# EAGLE design OpenRobot (EAGLE 9.5.2)
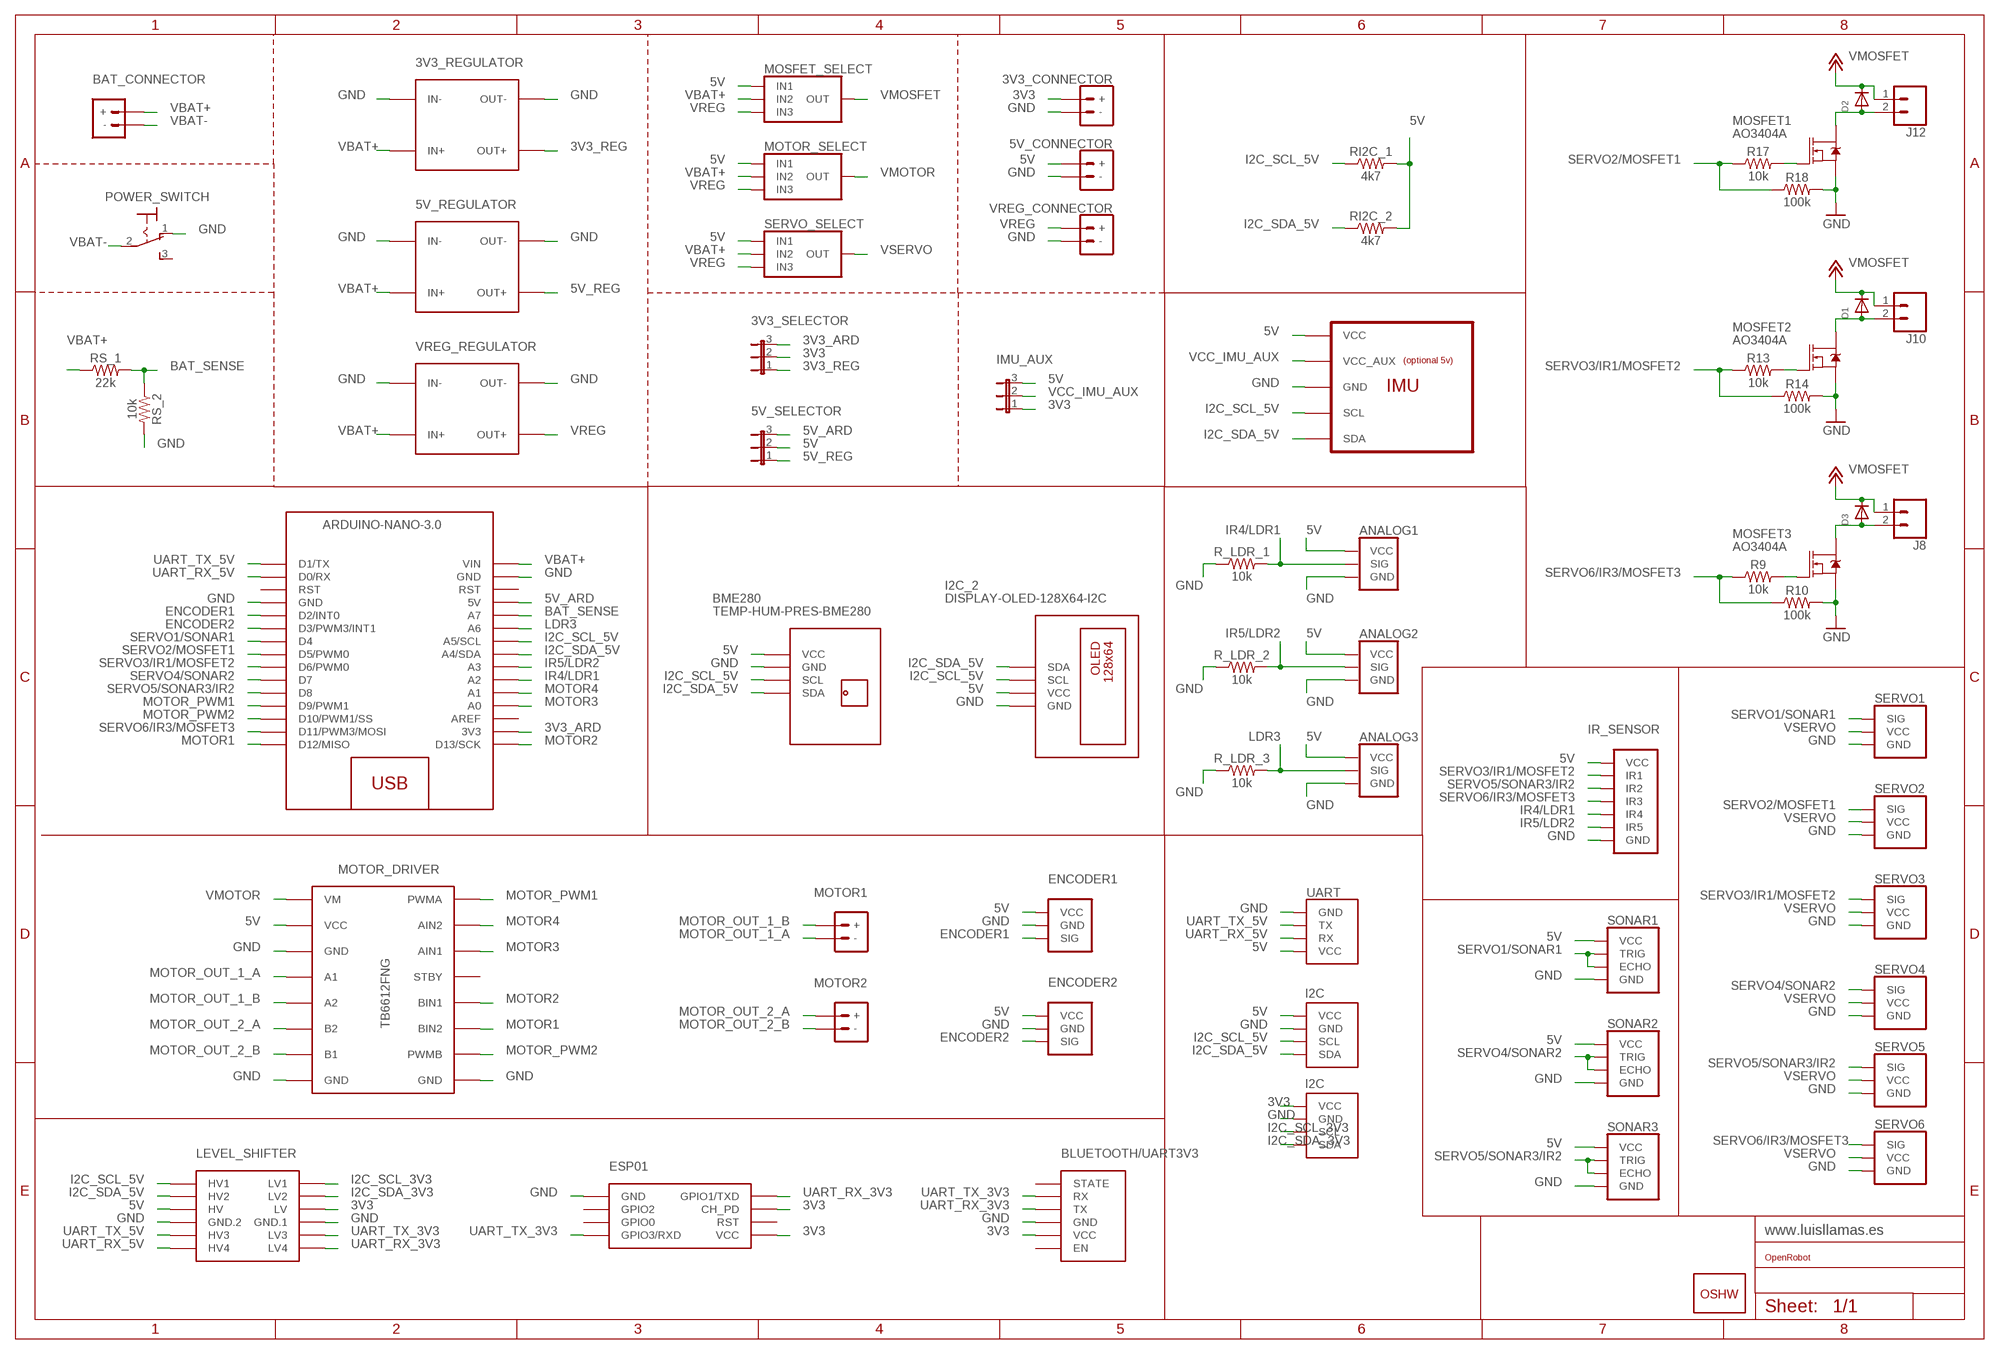
[diagram p0: schematic, sheet 1]

## Parts
3V3_CONNECTOR  MOTOR-TERMINAL2.54MM_SCREWTERM  [1X02_2.54_SCREWTERM]
3V3_REGULATOR  MINI-DC-STEP-DOWN-MP2307  [MINI-DC-STEP-DOWN-MP2307]
3V3_SELECTOR  1  JP2E  [JP2]
5V_CONNECTOR  MOTOR-TERMINAL2.54MM_SCREWTERM  [1X02_2.54_SCREWTERM]
5V_REGULATOR  MINI-DC-STEP-DOWN-MP2307  [MINI-DC-STEP-DOWN-MP2307]
5V_SELECTOR  1  JP2E  [JP2]
ANALOG1  LDR/OCT  [LDR]
ANALOG2  LDR/OCT  [LDR]
ANALOG3  LDR/OCT  [LDR]
ARDUINO_NANO1  ARDUINO-NANO-3.0  [ARDUINO-NANO-3.0]
BAT_CONNECTOR  POWER-TERMINAL5MM  [SCREWTERMINAL-5MM-2]
BLUETOOTH/UART3V3  BLUETOOTH-HC-05  [BLUETOOTH-HC-05]
BME280  TEMP-HUM-PRES-BME280  [TEMP-HUM-PRES-BME280]
D1  DIODESOD-123  [SOD-123]
D2  DIODESOD-123  [SOD-123]
D3  DIODESOD-123  [SOD-123]
ENCODER1  ENCODER/OCT  [ENCODER]
ENCODER2  ENCODER/OCT  [ENCODER]
GOLD_ORB_SM1  OSHWLOGO_GOLD_ORB_MED  [OSHW1]
I2C_1  I2C  GENERIC_I2CVCC_GND_SCL_SDA  [I2C_VCC_GND_SCL_SDA]
I2C_2  DISPLAY-OLED-128X64-I2C  [DISPLAY-OLED-128X64-I2C]
I2C_3  I2C  GENERIC_I2CVCC_GND_SCL_SDA  [I2C_VCC_GND_SCL_SDA]
IMU_AUX  1  JP2E  [JP2]
IR_SENSOR  IR-5/OCT  [IR-5]
J8  CONN_02LOCK_LONGPADS  [1X02_LOCK_LONGPADS]
J10  CONN_02LOCK_LONGPADS  [1X02_LOCK_LONGPADS]
J12  CONN_02LOCK_LONGPADS  [1X02_LOCK_LONGPADS]
LEVEL_SHIFTER  LEVEL-SHIFTER-4CH  [LEVEL-SHIFTER-4CH]
MOSFET1  AO3404A  MOSFET-NCH-AO3404A  [SOT23-3]
MOSFET2  AO3404A  MOSFET-NCH-AO3404A  [SOT23-3]
MOSFET3  AO3404A  MOSFET-NCH-AO3404A  [SOT23-3]
MOSFET_SELECT  JUMPER_3-1  [JUMPER_3-1]
MOTOR1  MOTOR-TERMINAL5MM  [SCREWTERMINAL-5MM-2]
MOTOR2  MOTOR-TERMINAL5MM  [SCREWTERMINAL-5MM-2]
MOTOR_DRIVER  TB6612FNG  [TB6612FNG]
MOTOR_SELECT  JUMPER_3-1  [JUMPER_3-1]
POWER_SWITCH  LEVER-POWER-SWITCH  [M9040P]
R9  10k  RESISTOR1206  [1206]
R10  100k  RESISTOR1206  [1206]
R13  10k  RESISTOR1206  [1206]
R14  100k  RESISTOR1206  [1206]
R17  10k  RESISTOR1206  [1206]
R18  100k  RESISTOR1206  [1206]
R_LDR_1  10k  RESISTOR1206  [1206]
R_LDR_2  10k  RESISTOR1206  [1206]
R_LDR_3  10k  RESISTOR1206  [1206]
RI2C_1  4k7  RESISTOR1206  [1206]
RI2C_2  4k7  RESISTOR1206  [1206]
RS_1  22k  RESISTOR1206  [1206]
RS_2  10k  RESISTOR1206  [1206]
SERVO1  SERVOSERVO  [SERVO]
SERVO2  SERVOSERVO  [SERVO]
SERVO3  SERVOSERVO  [SERVO]
SERVO4  SERVOSERVO  [SERVO]
SERVO5  SERVOSERVO  [SERVO]
SERVO6  SERVOSERVO  [SERVO]
SERVO_SELECT  JUMPER_3-1  [JUMPER_3-1]
SONAR1  ULTRASONIC/OCT  [ULTRASONIC]
SONAR2  ULTRASONIC/OCT  [ULTRASONIC]
SONAR3  ULTRASONIC/OCT  [ULTRASONIC]
U1  IMU_6/9/10DOFMPU6050  [IMU_6/9/10DOF]
U$1  ESP01  [ESP01]
UART  UART  GENERIC_UARTGND_TX_RX_VCC  [GENERIC_UART]
VREG_CONNECTOR  MOTOR-TERMINAL2.54MM_SCREWTERM  [1X02_2.54_SCREWTERM]
VREG_REGULATOR  MINI-DC-STEP-DOWN-MP2307  [MINI-DC-STEP-DOWN-MP2307]

## Nets
3V3: 3V3_CONNECTOR.+ 3V3_SELECTOR.2 BLUETOOTH/UART3V3.VCC I2C_3.VCC IMU_AUX.1 LEVEL_SHIFTER.J1.3(LV) U$1.CH_PD U$1.VCC
3V3_ARD: 3V3_SELECTOR.3 ARDUINO_NANO1.3V3
3V3_REG: 3V3_REGULATOR.OUT2.+(OUT+) 3V3_REGULATOR.OUT+ 3V3_SELECTOR.1
5V: 5V_CONNECTOR.+ 5V_SELECTOR.2 ANALOG1.VCC ANALOG2.VCC ANALOG3.VCC BME280.VCC ENCODER1.VCC ENCODER2.VCC I2C_1.VCC I2C_2.VCC IMU_AUX.3 IR_SENSOR.VCC LEVEL_SHIFTER.J2.3(HV) MOSFET_SELECT.IN1 MOTOR_DRIVER.VCC MOTOR_SELECT.IN1 RI2C_1.2 RI2C_2.2 SERVO_SELECT.IN1 SONAR1.VCC SONAR2.VCC SONAR3.VCC U1.VCC UART.VCC
5V_ARD: 5V_SELECTOR.3 ARDUINO_NANO1.5V
5V_REG: 5V_REGULATOR.OUT2.+(OUT+) 5V_REGULATOR.OUT+ 5V_SELECTOR.1
BAT_SENSE: ARDUINO_NANO1.A7 RS_1.2 RS_2.1
ENCODER1: ARDUINO_NANO1.D2(D2/INT0) ENCODER1.SIG
ENCODER2: ARDUINO_NANO1.D3(D3/PWM3/INT1) ENCODER2.SIG
GND: 3V3_CONNECTOR.- 3V3_REGULATOR.IN- 3V3_REGULATOR.OUT- 5V_CONNECTOR.- 5V_REGULATOR.IN- 5V_REGULATOR.OUT- ANALOG1.GND ANALOG2.GND ANALOG3.GND ARDUINO_NANO1.GND@1(GND) ARDUINO_NANO1.GND@2(GND) BLUETOOTH/UART3V3.GND BME280.GND ENCODER1.GND ENCODER2.GND I2C_1.GND I2C_2.GND I2C_3.GND IR_SENSOR.GND LEVEL_SHIFTER.J1.4(GND.1) LEVEL_SHIFTER.J2.4(GND.2) MOSFET1.2(S) MOSFET2.2(S) MOSFET3.2(S) MOTOR_DRIVER.GND1(GND) MOTOR_DRIVER.GND2(GND) MOTOR_DRIVER.GND3(GND) POWER_SWITCH.1(O) R10.2 R14.2 R18.2 R_LDR_1.1 R_LDR_2.1 R_LDR_3.1 RS_2.2 SERVO1.GND SERVO2.GND SERVO3.GND SERVO4.GND SERVO5.GND SERVO6.GND SONAR1.GND SONAR2.GND SONAR3.GND U1.GND U$1.GND UART.GND VREG_CONNECTOR.- VREG_REGULATOR.IN- VREG_REGULATOR.OUT-
I2C_SCL_3V3: I2C_3.SCL LEVEL_SHIFTER.J1.1(LV1)
I2C_SCL_5V: ARDUINO_NANO1.A5(A5/SCL) BME280.SCL I2C_1.SCL I2C_2.SCL LEVEL_SHIFTER.J2.1(HV1) RI2C_1.1 U1.SCL
I2C_SDA_3V3: I2C_3.SDA LEVEL_SHIFTER.J1.2(LV2)
I2C_SDA_5V: ARDUINO_NANO1.A4(A4/SDA) BME280.SDA I2C_1.SDA I2C_2.SDA LEVEL_SHIFTER.J2.2(HV2) RI2C_2.1 U1.SDA
IR4/LDR1: ANALOG1.SIG ARDUINO_NANO1.A2 IR_SENSOR.4(IR4) R_LDR_1.2
IR5/LDR2: ANALOG2.SIG ARDUINO_NANO1.A3 IR_SENSOR.5(IR5) R_LDR_2.2
LDR3: ANALOG3.SIG ARDUINO_NANO1.A6 R_LDR_3.2
MOTOR1: ARDUINO_NANO1.D12(D12/MISO) MOTOR_DRIVER.BIN2
MOTOR2: ARDUINO_NANO1.D13(D13/SCK) MOTOR_DRIVER.BIN1
MOTOR3: ARDUINO_NANO1.A0 MOTOR_DRIVER.AIN1
MOTOR4: ARDUINO_NANO1.A1 MOTOR_DRIVER.AIN2
MOTOR_OUT_1_A: MOTOR1.- MOTOR_DRIVER.A1
MOTOR_OUT_1_B: MOTOR1.+ MOTOR_DRIVER.A2
MOTOR_OUT_2_A: MOTOR2.+ MOTOR_DRIVER.B2
MOTOR_OUT_2_B: MOTOR2.- MOTOR_DRIVER.B1
MOTOR_PWM1: ARDUINO_NANO1.D9(D9/PWM1) MOTOR_DRIVER.PWMA
MOTOR_PWM2: ARDUINO_NANO1.D10(D10/PWM1/SS) MOTOR_DRIVER.PWMB
N$14: MOSFET3.1(G) R9.2
N$15: D3.A J8.2 MOSFET3.3(D)
N$20: MOSFET2.1(G) R13.2
N$21: D1.A J10.2 MOSFET2.3(D)
N$26: MOSFET1.1(G) R17.2
N$27: D2.A J12.2 MOSFET1.3(D)
SERVO1/SONAR1: ARDUINO_NANO1.D4 SERVO1.SIG SONAR1.ECHO SONAR1.TRIG
SERVO2/MOSFET1: ARDUINO_NANO1.D5(D5/PWM0) R17.1 R18.1 SERVO2.SIG
SERVO3/IR1/MOSFET2: ARDUINO_NANO1.D6(D6/PWM0) IR_SENSOR.1(IR1) R13.1 R14.1 SERVO3.SIG
SERVO4/SONAR2: ARDUINO_NANO1.D7 SERVO4.SIG SONAR2.ECHO SONAR2.TRIG
SERVO5/SONAR3/IR2: ARDUINO_NANO1.D8 IR_SENSOR.2(IR2) SERVO5.SIG SONAR3.ECHO SONAR3.TRIG
SERVO6/IR3/MOSFET3: ARDUINO_NANO1.D11(D11/PWM3/MOSI) IR_SENSOR.3(IR3) R9.1 R10.1 SERVO6.SIG
UART_RX_3V3: BLUETOOTH/UART3V3.TX LEVEL_SHIFTER.J1.6(LV4) U$1.TX(GPIO1/TXD)
UART_RX_5V: ARDUINO_NANO1.RX0(D0/RX) LEVEL_SHIFTER.J2.6(HV4) UART.RX
UART_TX_3V3: BLUETOOTH/UART3V3.RX LEVEL_SHIFTER.J1.5(LV3) U$1.RX(GPIO3/RXD)
UART_TX_5V: ARDUINO_NANO1.TX1(D1/TX) LEVEL_SHIFTER.J2.5(HV3) UART.TX
VBAT+: 3V3_REGULATOR.IN+ 3V3_REGULATOR.IN.2+(IN+) 5V_REGULATOR.IN+ 5V_REGULATOR.IN.2+(IN+) ARDUINO_NANO1.VIN BAT_CONNECTOR.+ MOSFET_SELECT.IN2 MOTOR_SELECT.IN2 RS_1.1 SERVO_SELECT.IN2 VREG_REGULATOR.IN+ VREG_REGULATOR.IN.2+(IN+)
VBAT-: BAT_CONNECTOR.- POWER_SWITCH.2(P)
VCC_IMU_AUX: IMU_AUX.2 U1.VCC_AUX
VMOSFET: D1.C D2.C D3.C J8.1 J10.1 J12.1 MOSFET_SELECT.OUT ; supply symbol labelled +12V
VMOTOR: MOTOR_DRIVER.VM MOTOR_SELECT.OUT
VREG: MOSFET_SELECT.IN3 MOTOR_SELECT.IN3 SERVO_SELECT.IN3 VREG_CONNECTOR.+ VREG_REGULATOR.OUT2.+(OUT+) VREG_REGULATOR.OUT+
VSERVO: SERVO1.VCC SERVO2.VCC SERVO3.VCC SERVO4.VCC SERVO5.VCC SERVO6.VCC SERVO_SELECT.OUT
Unconnected: ARDUINO_NANO1.REG(AREF) ARDUINO_NANO1.RST@1(RST) ARDUINO_NANO1.RST@2(RST) BLUETOOTH/UART3V3.EN BLUETOOTH/UART3V3.STATE MOTOR_DRIVER.STBY POWER_SWITCH.3(S) U$1.GPIO0 U$1.GPIO2 U$1.RST

## Library data of the parts
3V3_CONNECTOR 5V_CONNECTOR VREG_CONNECTOR = LLL_Motors:MOTOR-TERMINAL: Multi connection point. Often used as Generic Header-pin footprint for 0.1 inch spaced/style header connections On any of the 0.1 inch spaced packages, you can populate with these: Break Away Headers - Straight <https://www.sparkfun.com/products/116> (PRT-00116) Break Away Male Headers - Right Angle <https://www.sparkfun.com/products/553> (PRT-00553) Female Headers <https://www.sparkfun.com/products/115> (PRT-00115) Break Away Headers - Machine Pin <https://www.sparkfun.com/products/117> (PRT-00117) Break Away Female Headers - Swiss Machine Pin <https://www.sparkfun.com/products/743> (PRT-00743) For SCREWTERMINALS and SPRING TERMINALS visit here: Screw Terimnals on SparkFun.com <https://www.sparkfun.com/search/results?term=Screw+Terminals> (5mm/3.5mm/2.54mm spacing) This device is also useful as a general connection point to wire up your design to another part of your project. Our various solder wires solder well into these plated through hole pads. Hook-Up Wire - Assortment (Stranded, 22 AWG) <https://www.sparkfun.com/products/11375> (PRT-11375) Hook-Up Wire - Assortment (Solid Core, 22 AWG) <https://www.sparkfun.com/products/11367> (PRT-11367) View the entire wire category on our website here <https://www.sparkfun.com/categories/141> Special notes: Molex polarized connector foot print use with: PRT-08233 with associated crimp pins and housings. 2.54_SCREWTERM for use with PRT-10571. 3.5mm Screw Terminal footprints for PRT-08084 5mm Screw Terminal footprints for use with PRT-08432
3V3_REGULATOR 5V_REGULATOR VREG_REGULATOR = LLL_Power:MINI-DC-STEP-DOWN-MP2307: DC/DC Step-Down Regulator based on MP2307DN chip MP2307 datasheet available here: https://cdn-shop.adafruit.com/datasheets/MP2307_r1.9.pdf Click here to find device on ebay.com <http://www.ebay.com/sch/dc+dc+3a+mini+converter>
3V3_SELECTOR 5V_SELECTOR IMU_AUX = LLL_Jumpers:JP2E: JUMPER
ANALOG1-ANALOG3 = LLL_Headers:LDR: Header for LDR
ARDUINO_NANO1 = LLL_Arduino:ARDUINO-NANO-3.0: Arduino Nano 3.0 and compatible devices
BAT_CONNECTOR = LLL_Power:POWER-TERMINAL: Multi connection point. Often used as Generic Header-pin footprint for 0.1 inch spaced/style header connections On any of the 0.1 inch spaced packages, you can populate with these: Break Away Headers - Straight <https://www.sparkfun.com/products/116> (PRT-00116) Break Away Male Headers - Right Angle <https://www.sparkfun.com/products/553> (PRT-00553) Female Headers <https://www.sparkfun.com/products/115> (PRT-00115) Break Away Headers - Machine Pin <https://www.sparkfun.com/products/117> (PRT-00117) Break Away Female Headers - Swiss Machine Pin <https://www.sparkfun.com/products/743> (PRT-00743) For SCREWTERMINALS and SPRING TERMINALS visit here: Screw Terimnals on SparkFun.com <https://www.sparkfun.com/search/results?term=Screw+Terminals> (5mm/3.5mm/2.54mm spacing) This device is also useful as a general connection point to wire up your design to another part of your project. Our various solder wires solder well into these plated through hole pads. Hook-Up Wire - Assortment (Stranded, 22 AWG) <https://www.sparkfun.com/products/11375> (PRT-11375) Hook-Up Wire - Assortment (Solid Core, 22 AWG) <https://www.sparkfun.com/products/11367> (PRT-11367) View the entire wire category on our website here <https://www.sparkfun.com/categories/141> Special notes: Molex polarized connector foot print use with: PRT-08233 with associated crimp pins and housings. 2.54_SCREWTERM for use with PRT-10571. 3.5mm Screw Terminal footprints for PRT-08084 5mm Screw Terminal footprints for use with PRT-08432; SF_SKU: PRT-08432
BLUETOOTH/UART3V3 = LLL_Bluetooth:BLUETOOTH-HC-05: Bluetooth Transceiver Module based on HC-05 board Tutorial is available here: https://arduino-info.wikispaces.com/BlueTooth-HC05-HC06-Modules-How-To Click here to find device on ebay.com <http://www.ebay.com/sch/hc-05+module+rs232>
BME280 = LLL_Modules:TEMP-HUM-PRES-BME280: Digital Humidity-Temperature-Pressure Sensor based on BME280
D1-D3 = adafruit:DIODE: Diode SMADIODE - SMA Surface Mount Package 20V 1A Schottky Diode Digikey: 641-1014-6-ND DO-1N4148 - Through Hole Small Current Diode SOD-123 20V 1 A (.5mV Vf) Schottky Diode - Digikey: MBRX120TPMSCT-ND SOD-323 10V 570mA (.38mV Vf, 3ns) Schottky Diode - Digikey: ZLLS410CT-ND SOD-523 30V 30mA Schottky Diode (RB751S-40TE61) - Digikey: RB751S-40TE61CT-ND SOT23-R/W - SOT23 Package (R = Solder Paste/Reflow Ovens, W = Hand-Soldering) BAT54Film 40V 300mA - Digikey: 497-7162-1-ND
ENCODER1 ENCODER2 = LLL_Headers:ENCODER: Header for Servo
GOLD_ORB_SM1 = LLL_Frames:OSHWLOGO: These are Open-Source Hardware logos.
I2C_1 I2C_3 = LLL_Headers:GENERIC_I2C
I2C_2 = LLL_Headers:DISPLAY-OLED-128X64-I2C: Header for Dot Matrix OLED Module based on SSD1306
IR_SENSOR = LLL_Headers:IR-5: Header for sensor 5xIR
J8 J10 J12 = LLL_Connectors:CONN_02: Multi connection point. Often used as Generic Header-pin footprint for 0.1 inch spaced/style header connections On any of the 0.1 inch spaced packages, you can populate with these: Break Away Headers - Straight <https://www.sparkfun.com/products/116> (PRT-00116) Break Away Male Headers - Right Angle <https://www.sparkfun.com/products/553> (PRT-00553) Female Headers <https://www.sparkfun.com/products/115> (PRT-00115) Break Away Headers - Machine Pin <https://www.sparkfun.com/products/117> (PRT-00117) Break Away Female Headers - Swiss Machine Pin <https://www.sparkfun.com/products/743> (PRT-00743) For SCREWTERMINALS and SPRING TERMINALS visit here: Screw Terimnals on SparkFun.com <https://www.sparkfun.com/search/results?term=Screw+Terminals> (5mm/3.5mm/2.54mm spacing) This device is also useful as a general connection point to wire up your design to another part of your project. Our various solder wires solder well into these plated through hole pads. Hook-Up Wire - Assortment (Stranded, 22 AWG) <https://www.sparkfun.com/products/11375> (PRT-11375) Hook-Up Wire - Assortment (Solid Core, 22 AWG) <https://www.sparkfun.com/products/11367> (PRT-11367) View the entire wire category on our website here <https://www.sparkfun.com/categories/141> Special notes: Molex polarized connector foot print use with: PRT-08233 with associated crimp pins and housings. 2.54_SCREWTERM for use with PRT-10571. 3.5mm Screw Terminal footprints for PRT-08084 5mm Screw Terminal footprints for use with PRT-08432
LEVEL_SHIFTER = LLL_Power:LEVEL-SHIFTER-4CH: 4-Channel Bi-Directional Logic Level Converter based on BSS128 transistors Click here to find device on ebay.com <http://www.ebay.com/sch/i2c+logic+converter+module>
MOSFET1-MOSFET3 = SparkFun-DiscreteSemi:MOSFET-NCH: N-channel MOSFETs Voltage controlled devices that allow control of high current outputs. SparkFun Products: SparkFun OpenScale <https://www.sparkfun.com/products/13261> SparkFun Digital Sandbox <https://www.sparkfun.com/products/12651> SparkFun Monster Moto Shield <https://www.sparkfun.com/products/10182> SparkFun MOSFET Power Controller <https://www.sparkfun.com/products/11214>; PROD_ID: TRANS-12988; VALUE: 5.8A/30V/35mΩ
MOSFET_SELECT MOTOR_SELECT SERVO_SELECT = LLL_Jumpers:JUMPER_3-1: JUMPER
MOTOR1 MOTOR2 = LLL_Motors:MOTOR-TERMINAL: Multi connection point. Often used as Generic Header-pin footprint for 0.1 inch spaced/style header connections On any of the 0.1 inch spaced packages, you can populate with these: Break Away Headers - Straight <https://www.sparkfun.com/products/116> (PRT-00116) Break Away Male Headers - Right Angle <https://www.sparkfun.com/products/553> (PRT-00553) Female Headers <https://www.sparkfun.com/products/115> (PRT-00115) Break Away Headers - Machine Pin <https://www.sparkfun.com/products/117> (PRT-00117) Break Away Female Headers - Swiss Machine Pin <https://www.sparkfun.com/products/743> (PRT-00743) For SCREWTERMINALS and SPRING TERMINALS visit here: Screw Terimnals on SparkFun.com <https://www.sparkfun.com/search/results?term=Screw+Terminals> (5mm/3.5mm/2.54mm spacing) This device is also useful as a general connection point to wire up your design to another part of your project. Our various solder wires solder well into these plated through hole pads. Hook-Up Wire - Assortment (Stranded, 22 AWG) <https://www.sparkfun.com/products/11375> (PRT-11375) Hook-Up Wire - Assortment (Solid Core, 22 AWG) <https://www.sparkfun.com/products/11367> (PRT-11367) View the entire wire category on our website here <https://www.sparkfun.com/categories/141> Special notes: Molex polarized connector foot print use with: PRT-08233 with associated crimp pins and housings. 2.54_SCREWTERM for use with PRT-10571. 3.5mm Screw Terminal footprints for PRT-08084 5mm Screw Terminal footprints for use with PRT-08432; SF_SKU: PRT-08432
MOTOR_DRIVER = LLL_Motors:TB6612FNG
POWER_SWITCH = LLL_Power:LEVER-POWER-SWITCH: TOGGLE SWITCH Marquardt
R9 R10 R13 R14 R17 R18 R_LDR_1-R_LDR_3 RI2C_1 RI2C_2 RS_1 RS_2 = SparkFun-Resistors:RESISTOR: Generic Resistor Package
SERVO1-SERVO6 = LLL_Headers:SERVO: Header for servo
SONAR1-SONAR3 = LLL_Headers:ULTRASONIC: Header for ultrasonic sensor
U1 = LLL_IMUs:IMU_6/9/10DOF
U$1 = LLL_ESP8266:ESP01: ESP8266 Wifi module 01
UART = LLL_Headers:GENERIC_UART

## Net classes
0 default: clearance 0.205 mm

## Board
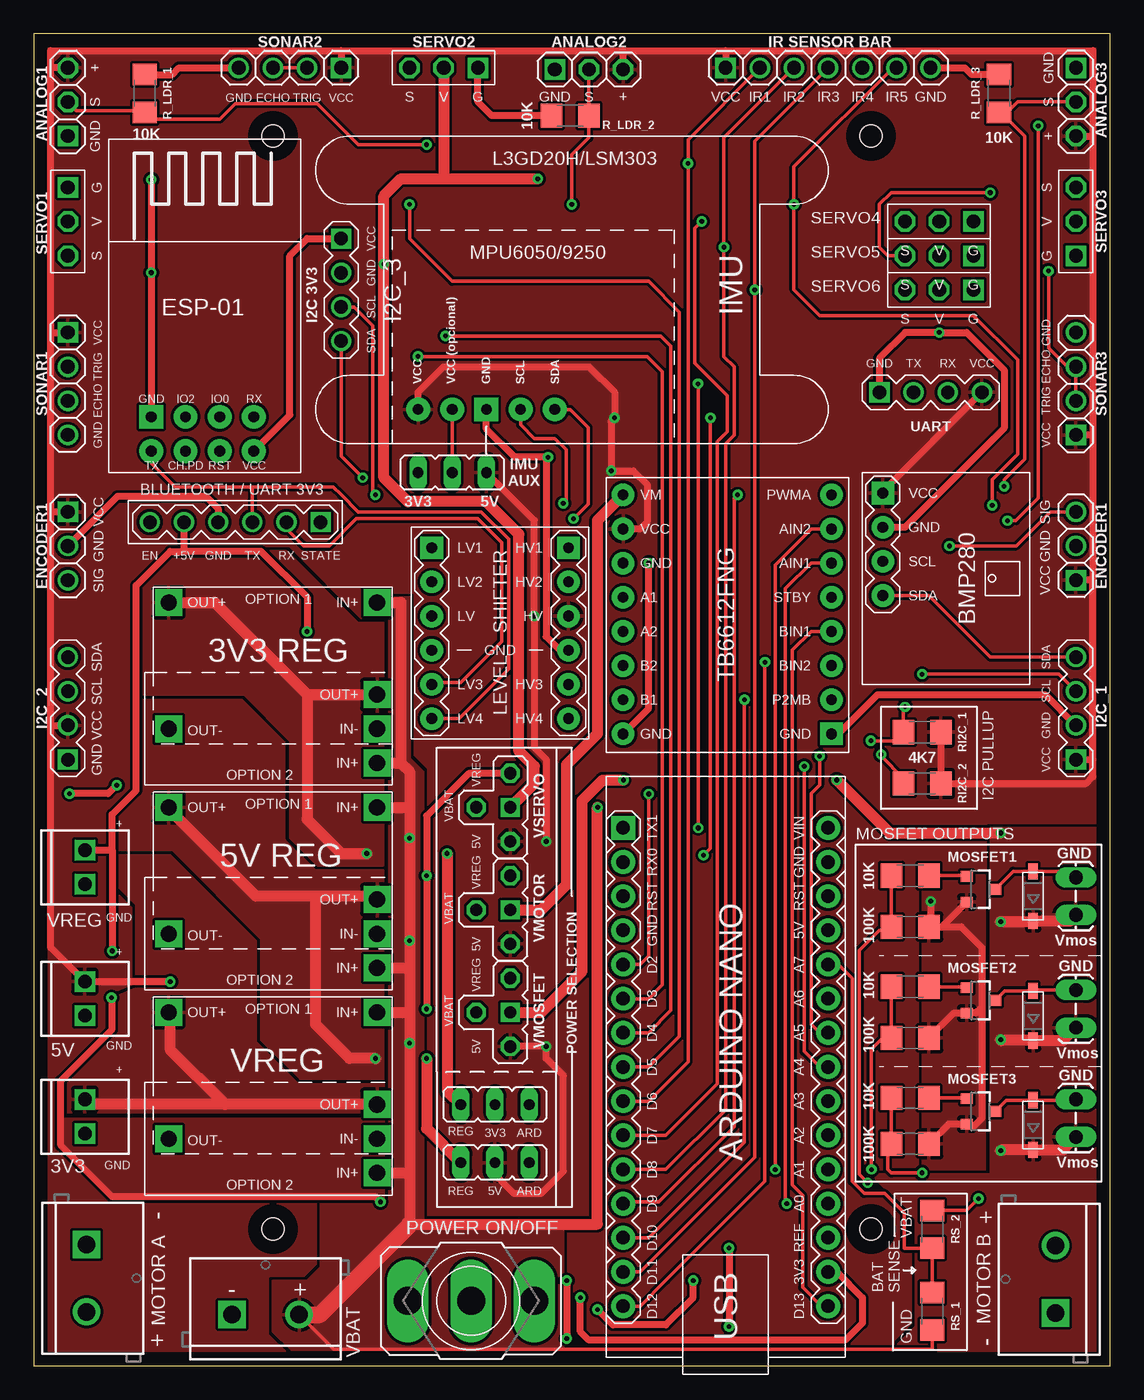
[diagram p1: board, top side]
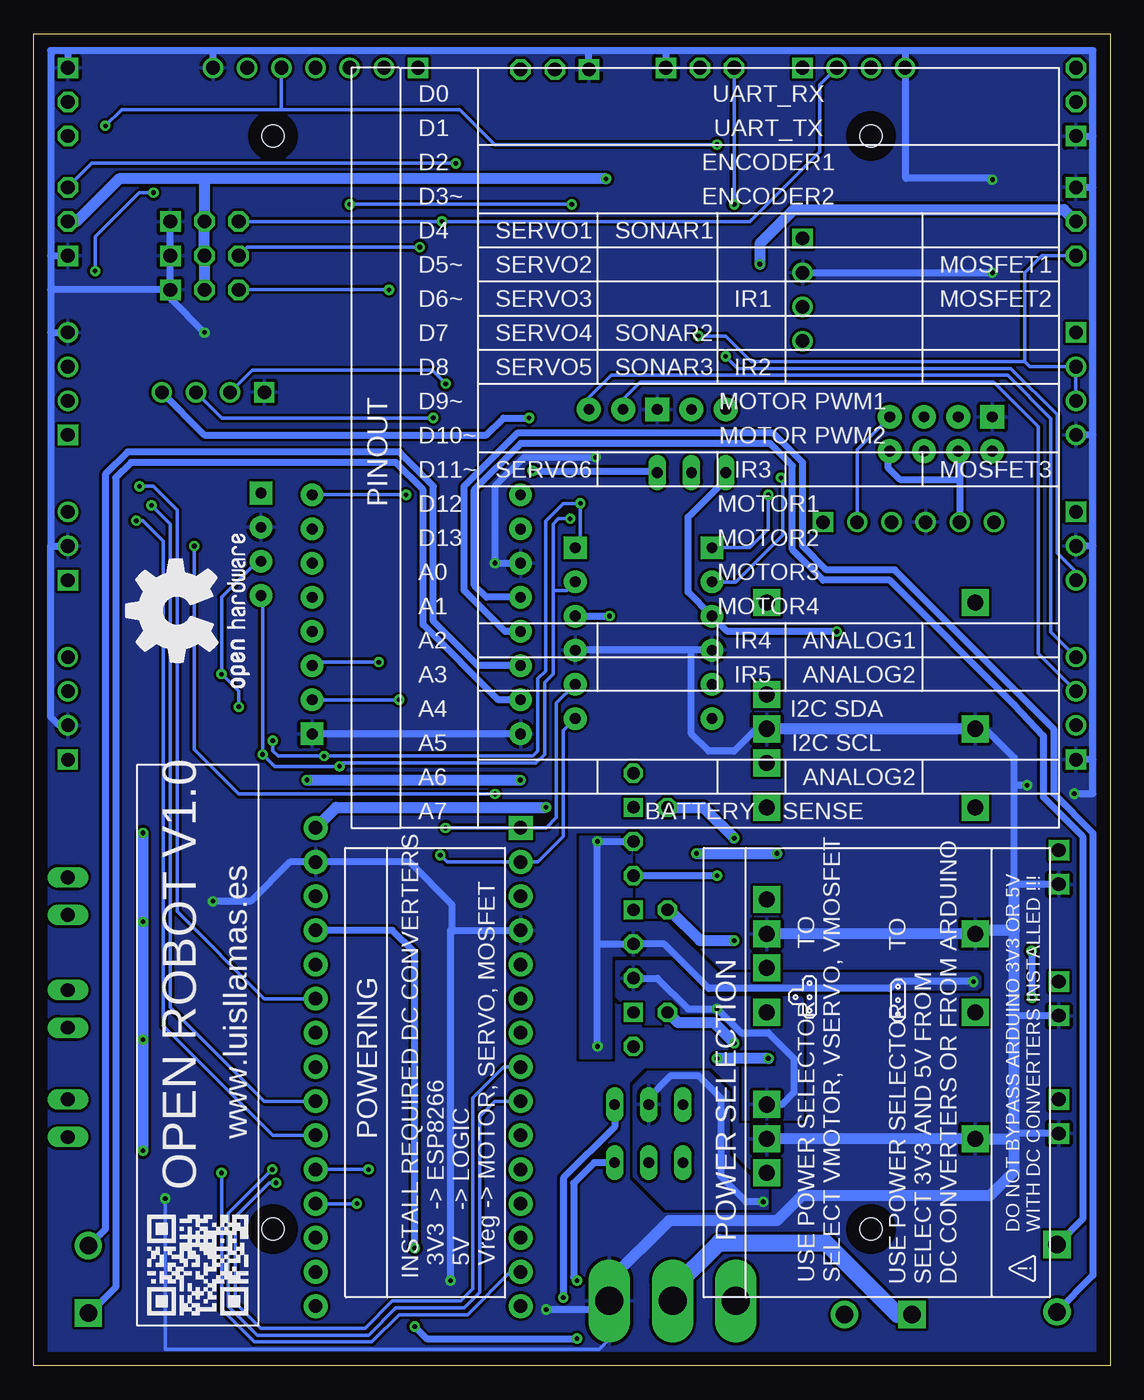
[diagram p2: board, bottom side, seen from below]

Size 80.01 x 99.06 mm. Coordinates in mm from the lower left corner, seen from the top.
Outline: 0,99.06 0,0 80.01,0 80.01,99.06 0,99.06
Copper layers (1*16): Top 0.035mm / dielectric 1.5mm / Bottom 0.035mm
Design rules "default": minimum track width 6mil, minimum drill 0.35mm, track to track 6mil, track to pad 6mil, pad to pad 6mil, via to via 6mil, smd to smd 6mil, copper to edge 40mil, drill to drill 6mil, minimum pad ring 10mil, minimum via ring 8mil, stop-mask expansion 4mil, vias tented up to drill 0mil, thermal gap 10mil
Holes 1.65 mm at 17.78,91.44 17.78,10.16 62.23,91.44 62.23,10.16

### Footprints (pad centres in the part's own frame; a part is rotated, then mirrored left to right if it is on the bottom)
1X02_2.54_SCREWTERM = drill 1.016 square: + 2.54,0; - 0,0
MINI-DC-STEP-DOWN-MP2307 = drill 1.2 pad 2 square: IN+ -7.747,-4.699; IN- -7.747,4.699; IN.2+ -7.747,7.239; OUT2.+ -7.747,2.159; OUT+ 7.747,-4.699; OUT- 7.747,4.699
JP2 = drill 0.8 long: 1 -2.54,0; 2 0,0; 3 2.54,0
LDR = drill 1.016 square: GND 0,0 | drill 1.016 octagon: SIG 2.54,0; VCC 5.08,0
ARDUINO-NANO-3.0 = drill 1 pad 1.778: 3V3 -15.24,-7.62; 5V 10.16,-7.62; A0 -10.16,-7.62; A1 -7.62,-7.62; A2 -5.08,-7.62; A3 -2.54,-7.62; A4 0,-7.62; A5 2.54,-7.62; A6 5.08,-7.62; A7 7.62,-7.62; D2 7.62,7.62; D3 5.08,7.62; D4 2.54,7.62; D5 0,7.62; D6 -2.54,7.62; D7 -5.08,7.62; D8 -7.62,7.62; D9 -10.16,7.62; D10 -12.7,7.62; D11 -15.24,7.62; D12 -17.78,7.62; D13 -17.78,-7.62; GND@1 10.16,7.62; GND@2 15.24,-7.62; REG -12.7,-7.62; RST@1 12.7,7.62; RST@2 12.7,-7.62; RX0 15.24,7.62; VIN 17.78,-7.62 | drill 1 pad 1.778 square: TX1 17.78,7.62
SCREWTERMINAL-5MM-2 = drill 1.3 pad 2.032: + 5,0 | drill 1.3 pad 2.032 square: - 0,0
BLUETOOTH-HC-05 = drill 1: EN 0.127,-12.7; GND 0.127,-7.62; RX 0.127,-2.54; TX 0.127,-5.08; VCC 0.127,-10.16 | drill 1 square: STATE 0.127,0
TEMP-HUM-PRES-BME280 = drill 0.8 pad 1.676: GND -5.08,3.81; SCL -5.08,1.27; SDA -5.08,-1.27 | drill 0.8 pad 1.676 square: VCC -5.08,6.35
SOD-123 = smd 1.2 x 0.7: A 1.85,0; C -1.85,0
ENCODER = drill 1.016: GND 2.54,0; SIG 5.08,0 | drill 1.016 square: VCC 0,0
I2C_VCC_GND_SCL_SDA = drill 1: GND 2.54,0; SCL 5.08,0; SDA 7.62,0 | drill 1 square: VCC 0,0
DISPLAY-OLED-128X64-I2C = drill 1 square: GND 0,0 | drill 1: SCL 5.08,0; SDA 7.62,0; VCC 2.54,0
IR-5 = drill 1.016: 1 -5.08,0; 2 -2.54,0; 3 0,0; 4 2.54,0; 5 5.08,0; GND 7.62,0 | drill 1.016 square: VCC -7.62,0
1X02_LOCK_LONGPADS = drill 1.016 long: 1 -0.127,0; 2 2.667,0
LEVEL-SHIFTER-4CH = drill 0.8 pad 1.676 square: J1.1 -5.08,6.35; J2.1 5.08,6.35 | drill 0.8 pad 1.676: J1.2 -5.08,3.81; J1.3 -5.08,1.27; J1.4 -5.08,-1.27; J1.5 -5.08,-3.81; J1.6 -5.08,-6.35; J2.2 5.08,3.81; J2.3 5.08,1.27; J2.4 5.08,-1.27; J2.5 5.08,-3.81; J2.6 5.08,-6.35
SOT23-3 = smd 0.8 x 0.9: 1 -0.95,-1; 2 0.95,-1; 3 0,1.1
JUMPER_3-1 = drill 0.914 octagon: IN1 -1.27,-1.27; IN2 -3.81,1.27; IN3 -1.27,3.81 | drill 0.914 square: OUT -1.27,1.27
TB6612FNG = drill 0.8 pad 1.676: A1 -7.62,1.27; A2 -7.62,-1.27; AIN1 7.874,3.81; AIN2 7.874,6.35; B1 -7.62,-6.35; B2 -7.62,-3.81; BIN1 7.874,-1.27; BIN2 7.874,-3.81; GND1 -7.62,3.81; GND2 -7.62,-8.89; PWMA 7.874,8.89; PWMB 7.874,-6.35; STBY 7.874,1.27; VCC -7.62,6.35; VM -7.62,8.89 | drill 0.8 pad 1.676 square: GND3 7.874,-8.89
M9040P = drill 2.083 long: 1 0,4.699; 2 0,0; 3 0,-4.699
1206 = smd 1.6 x 1.8: 1 -1.4,0; 2 1.4,0
SERVO = drill 1.016 square: GND -2.54,0 | drill 1.016 octagon: SIG 2.54,0; VCC 0,0
ULTRASONIC = drill 1.016: ECHO 1.27,0; GND 3.81,0; TRIG -1.27,0 | drill 1.016 square: VCC -3.81,0
IMU_6/9/10DOF = drill 0.8 pad 1.778 square: GND -8.89,6.35 | drill 0.8 pad 1.778: SCL -8.89,3.81; SDA -8.89,1.27; VCC -8.89,11.43; VCC_AUX -8.89,8.89
ESP01 = drill 0.8 pad 1.778: CH_PD -1.285,-8.178; GPIO0 1.255,-5.638; GPIO2 -1.285,-5.638; RST 1.255,-8.178; RX 3.795,-5.638; TX -3.825,-8.178; VCC 3.795,-8.178 | drill 0.8 pad 1.778 square: GND -3.825,-5.638
GENERIC_UART = drill 1 square: GND 0,0 | drill 1: RX 5.08,0; TX 2.54,0; VCC 7.62,0

### Placement (x,y rotation side)
3V3_CONNECTOR  3.81,35.81 90 top
3V3_REGULATOR  17.78,52.07 180 top
3V3_SELECTOR  34.29,19.43 0 top
5V_CONNECTOR  3.81,26.04 90 top
5V_REGULATOR  17.78,36.83 180 top
5V_SELECTOR  34.29,15.11 0 top
ANALOG1  2.54,91.44 90 top
ANALOG2  38.73,96.39 0 top
ANALOG3  77.47,96.52 270 top
ARDUINO_NANO1  51.44,22.23 90 top
BAT_CONNECTOR  14.73,3.81 0 top
BLUETOOTH/UART3V3  21.34,62.87 270 top
BME280  68.2,58.55 0 top
D1  74.3,26.04 90 top
D2  74.3,34.92 90 top
D3  74.3,17.91 90 top
ENCODER1  77.47,58.42 90 top
ENCODER2  2.54,63.5 270 top
GOLD_ORB_SM1  62.23,49.78 90 bottom
I2C_1  77.47,45.09 90 top
I2C_2  2.54,45.09 90 top
I2C_3  22.86,83.82 270 top
IMU_AUX  31.11,66.42 0 top
IR_SENSOR  59.05,96.52 0 top
J8  77.47,17.14 90 top
J10  77.47,25.27 90 top
J12  77.47,33.66 90 top
LEVEL_SHIFTER  34.67,54.48 0 top
MOSFET1  70.36,35.43 270 top
MOSFET2  70.36,27.18 270 top
MOSFET3  70.36,18.92 270 top
MOSFET_SELECT  36.7,25.02 0 top
MOTOR1  3.94,9.02 270 top
MOTOR2  75.95,3.94 90 top
MOTOR_DRIVER  51.44,55.88 0 top
MOTOR_SELECT  36.7,32.64 0 top
POWER_SWITCH  32.51,4.83 270 top
R9  65.15,19.94 0 top
R10  65.15,16.51 0 top
R13  65.15,28.19 0 top
R14  65.15,24.38 0 top
R17  65.15,36.45 0 top
R18  65.15,32.64 0 top
R_LDR_1  8.26,94.61 270 top
R_LDR_2  39.88,92.96 0 top
R_LDR_3  71.75,94.61 270 top
RI2C_1  66.04,47.12 0 top
RI2C_2  66.04,43.31 0 top
RS_1  66.8,4.06 90 top
RS_2  66.8,10.16 90 top
SERVO1  2.54,85.09 270 top
SERVO2  30.48,96.52 180 top
SERVO3  77.47,85.09 90 top
SERVO4  67.31,85.09 180 top
SERVO5  67.31,82.55 180 top
SERVO6  67.31,80.01 180 top
SERVO_SELECT  36.7,40.26 0 top
SONAR1  2.54,73.03 270 top
SONAR2  19.05,96.52 180 top
SONAR3  77.47,73.03 90 top
U1  40.01,80.01 90 top
U$1  12.57,76.2 0 top
UART  62.87,72.39 0 top
VREG_CONNECTOR  3.81,17.27 90 top
VREG_REGULATOR  17.78,21.59 180 top

### Tracks (layer width: path | path; a pad name or v marks a point on that pad's centre or on a via)
3V3  (via drill 0.35)
  Top 0.508: U$1.VCC 19.05,70.7 19.05,82.55 20.32,83.82 I2C_3.VCC | v25.78,12.19 25.4,12.57 5.84,12.57 2.03,16.38 2.03,21.21 5.79,24.97 v5.79,27.38 | 5.84,38.35 v5.84,30.86 | BLUETOOTH/UART3V3.VCC 11.18,60.56 | v20.32,54.61 20.32,57.15 16.91,60.56 11.18,60.56 | 5.84,38.35 5.84,41.01 7.62,42.78 7.62,58.04 10.14,60.56 11.18,60.56 | 3V3_CONNECTOR.+ 5.84,38.35
  Bottom 0.508: v25.78,12.19 27.05,12.19 28.96,14.1 28.96,19.94 30.61,21.59 32.64,21.59 34.29,19.94 3V3_SELECTOR.2 | v20.32,54.61 28.45,54.61 LEVEL_SHIFTER.J1.3 31.37,57.53 31.37,63.12 28.57,65.91 IMU_AUX.1 | 11.16,65.91 11.16,62.75 BLUETOOTH/UART3V3.VCC | U$1.CH_PD 11.16,67.89 11.16,65.91 | v5.79,27.38 5.79,30.81 v5.84,30.86 | 11.16,65.91 15.62,65.91 16.51,66.8 16.51,67.88 U$1.VCC
  pour Top: 2.03,18.41 26.04,18.41 26.04,12.45 5.97,12.45 2.03,16.38
  pour Bottom: 33.02,11.68 25.4,11.68 25.4,13.97 26.67,13.97 28.32,15.62 28.32,20.32 29.84,21.84 34.42,21.84 35.43,20.83 35.43,14.1
3V3_ARD  (via drill 0.35)
  Top 0.508: v40.64,5.08 40.64,2.54 41.27,1.91 60.33,1.91 61.59,3.17 61.59,5.08 59.69,6.99 ARDUINO_NANO1.3V3
  Bottom 0.508: 3V3_SELECTOR.3 36.83,17.78 40.64,13.97 v40.64,5.08
3V3_REG  (via drill 0.35)
  Top 0.813: 20.32,49.91 13.46,56.77 3V3_REGULATOR.OUT+ | 20.32,49.91 3V3_REGULATOR.OUT2.+ | 20.32,49.91 20.32,40.64 22.86,38.1 v24.77,38.1 | v30.73,38.1 30.76,38.1 30.76,20.42 3V3_SELECTOR.1
  Bottom 0.813: v30.73,38.1 v24.77,38.1
  pour Top: 26.04,37.21 26.04,55.24 24.13,55.24 18.8,60.58 10.16,60.58 7.62,58.04 7.62,49.91 15.62,49.91 19.05,46.48 19.05,39.24 21.08,37.21
5V  (via drill 0.35)
  Top 0.508: 5V_SELECTOR.2 34.29,14.22 35.69,12.83 37.72,12.83 39.37,14.48 39.37,21.59 38.1,22.86 v38.1,23.75 MOSFET_SELECT.IN1 | v10.16,28.57 5V_CONNECTOR.+ 1.27,31.11 1.27,47.62 | v38.1,38.99 38.1,45.09 37.21,45.97 v37.21,55.75 37.21,62.87 IMU_AUX.3 | MOTOR_DRIVER.VCC 45.09,62.23 45.59,62.74 45.59,65.53 44.58,66.55 v42.93,66.55 42.93,70.23 v43.18,70.48 43.18,72.39 41.27,74.3 30.48,74.3 28.57,72.39 U1.VCC | UART.VCC 63.12,65.02 BME280.VCC | I2C_1.VCC 78.74,45.09 | 78.74,45.09 78.74,58.42 | 78.74,58.42 ENCODER1.VCC | 1.27,47.62 I2C_2.VCC | 1.27,47.62 1.27,63.5 | ENCODER2.VCC 1.27,63.5 | 1.27,63.5 1.27,76.83 | 1.27,76.83 SONAR1.VCC | 1.27,76.83 1.27,96.52 | 1.27,96.52 1.27,97.79 22.86,97.79 | 22.86,97.79 SONAR2.VCC | 43.81,97.79 51.44,97.79 | 51.44,97.79 IR_SENSOR.VCC | 78.74,91.44 78.74,69.22 | 78.74,69.22 SONAR3.VCC | 78.74,69.22 78.74,58.42 | RI2C_1.2 RI2C_2.2 78.23,43.31 78.74,43.81 78.74,45.09 | ANALOG3.VCC 78.74,91.44 | 51.44,97.79 78.74,97.79 78.74,91.44 | ANALOG1.VCC 1.27,96.52 | ANALOG2.VCC 43.81,97.79 | 22.86,97.79 43.81,97.79
  Bottom 0.508: v10.16,28.57 15.88,28.57 16.38,28.07 29.84,28.07 33.15,31.37 MOTOR_SELECT.IN1 38.1,31.37 | v38.1,23.75 38.1,31.37 | 38.1,31.37 v38.1,38.99 SERVO_SELECT.IN1 | LEVEL_SHIFTER.J2.3 v37.21,55.75 | v43.18,70.48 45.09,70.48 46.35,69.22 67.31,69.22 UART.VCC | IMU_AUX.3 33.78,66.55 v42.93,66.55
  pour Top (rank 2): 0,0 0,99.06 80.01,99.06 80.01,0
  pour Bottom: 29.21,29.21 9.91,29.21 9.65,28.96 9.65,28.19 9.91,27.94 29.97,27.94 32.51,30.48 37.08,30.48 37.08,22.86 39.37,22.86 39.37,39.37 35.56,39.37 35.56,33.02 33.02,33.02
5V_ARD  (via drill 0.35)
  Top 0.508: v51.69,8.76 v51.69,2.92 | v39.62,6.35 v39.62,2.03
  Bottom 0.508: v51.69,8.76 51.69,30.73 53.34,32.38 ARDUINO_NANO1.5V | v51.69,2.92 50.8,2.03 v39.62,2.03 | v39.62,6.35 39.88,6.6 39.88,13.59 38.35,15.11 5V_SELECTOR.3
5V_REG  (via drill 0.35)
  Top 0.813: v25.4,22.86 23.5,22.86 20.95,25.4 20.95,34.92 | v29.21,22.86 29.21,17.65 5V_SELECTOR.1 | 5V_REGULATOR.OUT+ 10.03,41.4 16.51,34.92 20.95,34.92 | 5V_REGULATOR.OUT2.+ 25.53,34.92 20.95,34.92
  Bottom 0.813: v25.4,22.86 v29.21,22.86
  pour Top: 7.59,42.53 5.84,41.15 5.97,41.02 5.97,38.35 10.29,38.35 16.89,31.75 16.89,24.26 19.81,21.34 26.04,21.34 26.04,36.83 20.95,36.83 18.67,39.12 18.67,46.35 15.49,49.53 7.59,49.53
BAT_SENSE
  Top 0.254: ARDUINO_NANO1.A7 59.82,29.84 60.83,28.83 60.83,13.72 61.72,12.83 63.25,12.83 64.71,11.37 64.71,8.76 RS_2.1 RS_1.2
ENCODER1  (via drill 0.35)
  Top 0.254: ARDUINO_NANO1.D2 45.09,29.84 45.72,30.48 v45.72,42.52 | v68.07,60.96 73.03,60.96 75.56,63.5 ENCODER1.SIG
  Bottom 0.254: v45.72,42.52 64.75,42.52 68.07,45.85 v68.07,60.96
ENCODER2  (via drill 0.35)
  Top 0.254: ARDUINO_NANO1.D3 45.72,27.3 46.74,28.32 46.74,73.91 45.59,75.06 v28.57,75.06
  Bottom 0.254: v28.57,75.06 27.69,74.17 7.37,74.17 3.94,70.74 3.94,60.45 2.54,59.05 ENCODER2.SIG
GND  (via drill 0.35)
  Top 0.254: v70.23,12.45 69.34,11.56 RS_2.2
  Top 0.508: 66.67,32.64 R18.2 68.96,32.64 70.48,31.11 70.48,26.67 | 66.67,32.64 67.51,32.64 MOSFET1.2 | R14.2 68.39,26.23 MOSFET2.2 70.04,26.23 70.48,26.67 | R10.2 68.01,17.97 MOSFET3.2 69.55,17.78 69.85,17.78 70.48,18.41 70.48,26.67 | v41.91,4.19 43.05,3.05 46.99,3.05 49.02,5.08 v49.02,6.35 | LEVEL_SHIFTER.J2.4 39.12,53.21 38.1,54.23 38.1,67.44 v38.23,67.56 35.76,67.56 33.66,69.67 U1.GND | v45.72,59.69 45.72,48.9 MOTOR_DRIVER.GND2 | MOTOR_DRIVER.GND3 59.82,46.99 62.74,49.91 75.18,49.91 I2C_1.GND | R_LDR_1.1 10.29,96.02 10.79,96.52 SONAR2.GND | R_LDR_2.1 34.04,92.96 33.02,93.98 SERVO2.GND | BME280.GND 64.77,62.36 72.14,69.72 72.14,74.04 69.34,76.83 v67.31,76.83 64.77,76.83 62.87,74.93 UART.GND | ENCODER2.GND 6.22,64.64 12.83,64.64 13.72,63.75 BLUETOOTH/UART3V3.GND | v8.75,88.2 v8.75,81.28 U$1.GND | v66.67,34.54 66.67,32.64 | R_LDR_3.1 69.72,96.02 69.22,96.52 IR_SENSOR.GND | v6.17,43.18 5.54,42.55 v2.66,42.55
  Bottom 0.254: POWER_SWITCH.1 37.21,1.98 37.97,1.22 70.23,1.22 v70.23,12.45
  Bottom 0.508: VREG_CONNECTOR.- 7.11,17.27 | 5V_CONNECTOR.- 7.11,26.04 | 3V3_CONNECTOR.- 7.11,35.81 7.11,43.18 | v49.02,6.35 49.02,32.38 48.9,32.38 | 48.9,32.38 ARDUINO_NANO1.GND@1 | 48.9,32.38 48.9,34.29 52.07,37.47 ARDUINO_NANO1.GND@2 60.96,37.47 63.88,34.54 v66.67,34.54 | 3V3_REGULATOR.IN- 26.29,47.37 27.94,45.72 29.84,45.72 31.11,46.99 31.11,53.21 | LEVEL_SHIFTER.J1.4 31.11,53.21 | 31.11,53.21 LEVEL_SHIFTER.J2.4 | v38.23,67.56 43.56,67.56 45.72,65.41 v45.72,59.69 MOTOR_DRIVER.GND1 | MOTOR_DRIVER.GND2 MOTOR_DRIVER.GND3 | I2C_1.GND 78.11,47.62 78.74,48.26 78.74,60.96 | 78.74,60.96 ENCODER1.GND | v2.66,42.55 1.27,42.55 1.27,45.09 | 1.27,45.09 I2C_2.GND | 1.27,45.09 1.27,60.96 | 1.27,60.96 ENCODER2.GND | 1.27,60.96 1.27,69.22 | 1.27,69.22 SONAR1.GND | 1.27,69.22 1.27,87.63 | SERVO1.GND 1.27,87.63 | 1.27,87.63 1.27,91.44 | 1.27,91.44 1.27,97.79 15.24,97.79 | 15.24,97.79 SONAR2.GND 15.18,96.46 15.18,88.3 8.8,88.3 v8.75,88.2 | 15.24,97.79 33.02,97.79 | 33.02,97.79 SERVO2.GND | 33.02,97.79 38.73,97.79 | 66.67,97.79 77.47,97.79 | 77.47,97.79 78.74,97.79 78.74,82.55 | 78.74,82.55 SERVO3.GND | 78.74,82.55 78.74,80.01 | 78.74,80.01 78.74,76.83 | 78.74,76.83 SONAR3.GND | 78.74,76.83 78.74,60.96 | SERVO6.GND SERVO5.GND SERVO4.GND | SERVO6.GND 78.74,80.01 | SERVO6.GND 69.85,79.38 v67.31,76.83 | IR_SENSOR.GND 66.67,97.79 | 77.47,97.79 ANALOG3.GND | ANALOG2.GND 38.73,97.79 | ANALOG1.GND 1.27,91.44 | 38.73,97.79 66.67,97.79 | v41.91,4.19 37.97,4.19 37.34,4.83 POWER_SWITCH.1 | I2C_3.GND v8.75,81.28 | 7.11,43.18 7.11,45.21 9.27,47.37 3V3_REGULATOR.OUT- | 7.11,43.18 v6.17,43.18
  Bottom 0.813: 3V3_REGULATOR.OUT- 3V3_REGULATOR.IN- | 5V_REGULATOR.IN- 5V_REGULATOR.OUT- 10.03,32.38 7.11,32.38 | VREG_REGULATOR.IN- VREG_REGULATOR.OUT- 7.11,16.89 | 7.11,32.38 7.11,35.81 | 7.11,32.38 7.11,26.04 7.11,17.27 7.11,16.89 | 7.11,16.89 7.11,14.48 8.9,12.69 22.87,12.69 24.77,10.79 32.77,10.79 37.21,6.35 POWER_SWITCH.1
  pour Bottom (rank 2): 0,0 0,99.06 80.01,99.06 80.01,0
  pour Top: 70.74,36.45 66.04,36.45 66.04,14.61 70.74,14.61
I2C_SCL_3V3  (via drill 0.35)
  Top 0.254: v25.4,64.77 25.22,64.95 25.22,77.34 23.82,78.74 I2C_3.SCL
  Bottom 0.254: LEVEL_SHIFTER.J1.1 26.8,60.83 25.4,62.23 v25.4,64.77
I2C_SCL_5V  (via drill 0.35)
  Top 0.254: v58.42,45.34 58.42,43.18 57.78,42.55 57.78,25.4 58.42,24.77 ARDUINO_NANO1.A5 | I2C_1.SCL 76.2,51.44 v66.04,51.44 | v62.23,46.48 64.64,46.48 RI2C_1.1 64.64,48.87 v64.77,49 | U1.SCL 36.2,69.98 37.21,68.96 38.73,68.96 39.57,68.12 39.57,64.34 v39.37,64.14
  Bottom 0.254: BME280.SCL 63.37,59.82 66.04,57.15 v66.04,51.44 64.77,50.16 v64.77,49 | v62.23,46.48 62.23,45.72 61.85,45.34 v58.42,45.34 42.93,45.34 42.55,45.72 42.55,51.1 41.96,51.68 41.96,62.81 40.64,64.14 v39.37,64.14 39.37,61.21 LEVEL_SHIFTER.J2.1 | U1.SCL 36.07,71.25 36.07,72.01 34.92,73.15 8.64,73.15 5.33,69.85 5.33,52.96 I2C_2.SCL
I2C_SDA_3V3  (via drill 0.35)
  Top 0.254: v24.46,66.04 22.86,67.64 I2C_3.SDA
  Bottom 0.254: LEVEL_SHIFTER.J1.2 27.81,58.29 24.33,61.77 24.33,65.91 v24.46,66.04
I2C_SDA_5V  (via drill 0.35)
  Top 0.254: ARDUINO_NANO1.A4 58.42,22.23 57.28,23.37 v57.28,44.58 | BME280.SDA 66.55,57.28 71.12,52.7 I2C_1.SDA | v62.99,45.47 62.99,45.34 64.64,43.69 RI2C_2.1 | v40.13,62.99 40.13,63 41.22,64.09 41.22,69.78 39.88,71.12 U1.SDA
  Bottom 0.254: 41.4,57.66 41.4,51.44 42.04,50.8 42.04,45.47 42.67,44.83 57.02,44.83 v57.28,44.58 62.11,44.58 v62.99,45.47 62.99,57.28 BME280.SDA | 41.4,57.66 41.4,62.61 41.02,62.99 v40.13,62.99 | U1.SDA 38.73,72.01 37.08,73.66 7.62,73.66 4.4,70.44 4.4,54.56 I2C_2.SDA | 41.4,57.66 40.39,57.66 LEVEL_SHIFTER.J2.2
IR4/LDR1  (via drill 0.35)
  Top 0.254: v72.39,62.84 73,62.84 74.68,64.52 v74.68,92.2 | v29.21,90.81 24.13,90.81 21.08,93.85 14.99,93.85 13.84,92.71 8.89,92.71 8.38,93.22 R_LDR_1.2 8.26,93.34 3.17,93.34 ANALOG1.SIG
  Bottom 0.254: ARDUINO_NANO1.A2 62.23,17.14 70.36,25.27 70.36,61.32 71.9,62.87 72.37,62.87 v72.39,62.84 | v74.68,92.2 73.47,93.41 61.59,93.41 | 61.59,93.41 48.32,93.41 45.72,90.81 v29.21,90.81 | IR_SENSOR.4 61.59,93.41
IR5/LDR2  (via drill 0.35)
  Top 0.254: v71.25,63.98 71.25,65.89 73.15,67.79 73.15,74.81 69.85,78.11 58.42,78.11 56.52,80.01 v56.52,86.36 56.52,89.15 63.88,96.52 IR_SENSOR.5 | v40.01,86.36 40.01,90.04 41.28,91.31 R_LDR_2.2 ANALOG2.SIG
  Bottom 0.254: v71.25,63.98 69.85,62.59 69.85,26.67 62.87,19.68 ARDUINO_NANO1.A3 | v56.52,86.36 v40.01,86.36
LDR3  (via drill 0.35)
  Top 0.254: 72.14,92.96 73.66,91.44 73.66,67.44 72.14,65.91 v72.14,65.41 | 72.14,92.96 72.01,92.96 R_LDR_3.2 | 72.14,92.96 73.15,93.98 ANALOG3.SIG
  Bottom 0.254: ARDUINO_NANO1.A6 62.87,27.3 69.34,33.78 69.34,63.63 71.12,65.41 v72.14,65.41
MOTOR1  (via drill 0.35)
  Top 0.254: ARDUINO_NANO1.D12 45.09,4.45 46.99,6.35 54.36,13.72 v54.36,52.32
  Bottom 0.254: MOTOR_DRIVER.BIN2 59.31,52.32 v54.36,52.32
MOTOR2
  Top 0.254: ARDUINO_NANO1.D13 58.55,4.45 57.15,5.84 57.15,12.7 56.39,13.46 56.39,53.21 57.78,54.61 MOTOR_DRIVER.BIN1
MOTOR3  (via drill 0.35)
  Top 0.254: MOTOR_DRIVER.AIN1 57.78,59.69 55.88,57.78 55.88,12.17 v55.98,12.06
  Bottom 0.254: v55.98,12.06 ARDUINO_NANO1.A0
MOTOR4  (via drill 0.35)
  Top 0.254: MOTOR_DRIVER.AIN2 57.78,62.23 55.12,59.56 v55.12,14.61
  Bottom 0.254: v55.12,14.61 ARDUINO_NANO1.A1
MOTOR_OUT_1_A
  Bottom 0.508: MOTOR_DRIVER.A1 46.35,57.15 47.24,58.04 47.24,65.15 43.81,68.58 25.27,68.58 23.62,66.93 23.62,60.71 21.34,58.42 16.39,58.42 7.11,49.14 4.95,46.84 4.95,42.29 2.03,39.37 2.03,10.92 MOTOR1.-
MOTOR_OUT_1_B
  Bottom 0.508: MOTOR_DRIVER.A2 44.96,54.61 48.01,57.66 48.01,65.41 44.07,69.34 25.02,69.34 22.86,67.18 22.86,60.96 21.08,59.18 16,59.18 4.19,47.37 4.19,42.55 1.27,39.62 1.27,6.73 3.94,4.06 MOTOR1.+
MOTOR_OUT_2_A
  Bottom 0.508: MOTOR_DRIVER.B2 46.99,52.07 50.29,55.37 50.29,65.41 52.83,67.94 73.03,67.94 74.68,66.29 74.68,10.16 75.92,8.91 MOTOR2.+
MOTOR_OUT_2_B
  Bottom 0.508: MOTOR_DRIVER.B1 45.47,49.53 51.05,55.12 51.05,65.15 53.09,67.18 72.77,67.18 73.91,66.04 73.91,5.84 75.82,3.94 MOTOR2.-
MOTOR_PWM1  (via drill 0.35)
  Top 0.254: ARDUINO_NANO1.D9 43.81,12.19 46.48,12.19 52.07,17.78 52.07,64.52 v52.32,64.77
  Bottom 0.254: v52.32,64.77 MOTOR_DRIVER.PWMA
MOTOR_PWM2  (via drill 0.35)
  Top 0.254: ARDUINO_NANO1.D10 45.72,9.53 52.83,16.64 v52.83,49.53
  Bottom 0.254: v52.83,49.53 MOTOR_DRIVER.PWMB
N$14
  Top 0.254: R9.2 69.29,19.94 MOSFET3.1
N$15
  Top 0.254: MOSFET3.3 72.29,19.76 D3.A 77.42,19.76 J8.2
N$20
  Top 0.254: R13.2 69.29,28.19 MOSFET2.1
N$21
  Top 0.254: MOSFET2.3 72.17,27.89 D1.A 74.35,27.94 J10.2
N$26
  Top 0.254: R17.2 69.29,36.45 MOSFET1.1
N$27
  Top 0.254: J12.2 77.41,36.26 76.89,36.77 D2.A 72.8,36.77 MOSFET1.3
SERVO1/SONAR1  (via drill 0.35)
  Top 0.254: ARDUINO_NANO1.D4 45.72,24.77 47.37,26.42 47.37,75.82 46.61,76.58 v30.61,76.58
  Bottom 0.254: v30.61,76.58 28.57,76.58 26.67,74.68 6.35,74.68 | 6.35,74.68 6.35,81.28 5.08,82.55 SERVO1.SIG | 6.35,74.68 5.97,74.3 SONAR1.TRIG SONAR1.ECHO
SERVO2/MOSFET1  (via drill 0.35)
  Top 0.254: ARDUINO_NANO1.D5 45.72,22.23 48.01,24.51 48.01,78.36 45.72,80.64 31.11,80.64 27.94,83.82 v27.94,86.36 | R17.1 R18.1 63.5,32.38 62.87,32.38 61.36,30.88 61.36,14.25 v62,13.61
  Bottom 0.254: ARDUINO_NANO1.D5 45.09,22.23 47.37,19.94 47.37,5.71 48.26,4.83 53.34,4.83 55.37,2.79 63.12,2.79 65.02,4.7 65.02,11.09 62.51,13.61 v62,13.61 | v27.94,86.36 SERVO2.SIG
SERVO3/IR1/MOSFET2  (via drill 0.35)
  Top 0.254: ARDUINO_NANO1.D6 45.72,19.68 48.64,22.61 v48.64,89.41 48.64,91.19 IR_SENSOR.1 | R13.1 R14.1 63.12,24.38 62.27,23.54 v62.27,14.61
  Bottom 0.254: ARDUINO_NANO1.D6 45.72,19.68 46.87,18.54 46.87,5.46 48.01,4.32 53.09,4.32 55.12,2.29 63.37,2.29 65.53,4.45 65.53,11.35 v62.27,14.61 | v48.64,89.41 75.69,89.41 SERVO3.SIG
SERVO4/SONAR2  (via drill 0.35)
  Top 0.254: v49.66,85.09 49.15,84.58 49.15,74.55 51.56,72.14 51.56,69.47 50.8,68.71 50.8,20.95 46.99,17.14 ARDUINO_NANO1.D7 | SONAR2.ECHO SONAR2.TRIG
  Bottom 0.254: SERVO4.SIG v49.66,85.09 26.8,85.09 21.59,90.3 21.59,95.25 SONAR2.TRIG
SERVO5/SONAR3/IR2  (via drill 0.35)
  Top 0.254: ARDUINO_NANO1.D8 46.99,14.61 51.44,19.05 51.44,68.58 52.07,69.22 52.07,74.3 51.31,75.06 v51.31,83.19 51.31,91.31 IR_SENSOR.2 | SONAR3.TRIG SONAR3.ECHO 76.83,74.3 75.44,75.69 v75.44,81.41 | SERVO5.SIG 63.5,82.55 62.87,83.19 62.87,86.36 63.75,87.25 71,87.25 v71.1,87.23
  Bottom 0.254: SERVO5.SIG 64.14,83.19 v51.31,83.19 | v75.44,81.41 75.44,83.95 72.16,87.23 v71.1,87.23
SERVO6/IR3/MOSFET3  (via drill 0.35)
  Top 0.254: ARDUINO_NANO1.D11 45.09,6.99 53.59,15.49 v53.59,80.01 53.59,91.06 IR_SENSOR.3 | R9.1 R10.1 63.5,16.26 63.5,14.61 63.75,14.35 v66.04,14.35
  Bottom 0.254: ARDUINO_NANO1.D11 44.58,6.99 47.75,3.81 52.83,3.81 54.86,1.78 63.63,1.78 66.04,4.19 v66.04,14.35 | v53.59,80.01 SERVO6.SIG
UART_RX_3V3
  Top 0.254: LEVEL_SHIFTER.J1.6 31.62,48.13 35.31,51.82 35.31,61.47 33.27,63.5 24.13,63.5 22.86,64.77 22.27,65.36 16.26,65.36 | 16.26,65.36 BLUETOOTH/UART3V3.TX | 16.26,65.36 10.53,65.36 8.75,67.13 U$1.TX
UART_RX_5V  (via drill 0.35)
  Top 0.254: v50.31,70.48 50.29,70.46 50.29,38.48 v49.78,37.97
  Bottom 0.254: LEVEL_SHIFTER.J2.6 40.64,47.24 40.64,39.37 42.55,37.47 ARDUINO_NANO1.RX0 49.28,37.47 v49.78,37.97 | UART.RX 66.04,70.48 v50.31,70.48
UART_TX_3V3
  Top 0.254: LEVEL_SHIFTER.J1.5 29.59,50.8 31.75,50.8 34.8,53.85 34.8,61.21 33.03,62.98 24,62.98 21.97,60.96 20.07,60.96 18.8,62.23 BLUETOOTH/UART3V3.RX
  Bottom 0.254: BLUETOOTH/UART3V3.RX 18.8,68.14 U$1.RX
UART_TX_5V  (via drill 0.35)
  Top 0.254: v49.38,73.03 49.4,73 v49.4,40.01
  Bottom 0.254: LEVEL_SHIFTER.J2.5 41.15,49.28 41.15,40.77 41.91,40.01 ARDUINO_NANO1.TX1 v49.4,40.01 | v49.38,73.03 50.4,74.04 63.75,74.04 UART.TX
VBAT+  (via drill 0.35)
  Top 0.254: 27.94,10.49 27.94,10.54 | BAT_CONNECTOR.+ 22.32,1.22 66.8,1.22 RS_1.1
  Top 0.508: 41.91,41.53 v41.93,41.53
  Top 0.813: 41.91,41.53 41.91,10.54 27.94,10.54 27.94,14.35 | VREG_REGULATOR.IN+ 27.94,26.29 | 27.94,26.29 v27.94,24 27.94,14.35 | VREG_REGULATOR.IN.2+ 27.94,14.35 | 5V_REGULATOR.IN.2+ 27.94,29.59 | 27.94,29.59 27.94,26.29 | 5V_REGULATOR.IN+ 27.94,41.53 | 27.94,41.53 v27.94,39.24 v27.94,31.62 27.94,29.59 | 3V3_REGULATOR.IN.2+ 27.3,44.83 | 27.3,44.83 27.94,44.2 27.94,41.53 | 3V3_REGULATOR.IN+ 27.3,56.77 27.3,44.83
  Top 1.27: BAT_CONNECTOR.+ 21.26,3.81 27.94,10.49
  Bottom 0.813: MOTOR_SELECT.IN2 32.77,33.91 30.48,31.62 v27.94,31.62 | MOSFET_SELECT.IN2 32.13,25.53 29.46,25.53 v27.94,24 | SERVO_SELECT.IN2 30.23,41.53 v27.94,39.24 | v41.93,41.53 57.53,41.53 ARDUINO_NANO1.VIN
  pour Top: 39.37,1.14 19.18,1.14 17.78,2.54 17.78,6.35 20.32,6.35 21.34,7.37 21.34,12.06 26.42,12.06 26.42,57.15 27.94,57.15 27.94,45.21 28.96,44.2 28.96,10.56 39.37,10.56
VBAT-
  Bottom 1.27: BAT_CONNECTOR.- 15.79,3.81 21.14,9.17 29.06,9.17 32.51,5.71 POWER_SWITCH.2
VCC_IMU_AUX
  Top 0.254: IMU_AUX.2 U1.VCC_AUX
VMOSFET  (via drill 0.35)
  Top 0.813: MOSFET_SELECT.OUT 37.72,26.29 40.77,29.34 40.77,42.04 42.29,43.56 v43.84,43.56 | v59.69,43.56 63.63,39.62 v71.88,39.62 | v71.88,16 71.94,16.06 D3.C 76.51,16.06 J8.1 | v71.88,24.26 71.95,24.18 D1.C 76.51,24.18 J10.1 | v71.88,33.02 74.24,33.02 D2.C 77.02,33.08 J12.1
  Bottom 0.813: v59.69,43.56 v43.84,43.56 | v71.88,39.62 v71.88,33.02 v71.88,24.26 v71.88,16
  pour Top: 80.01,40.01 71.12,40.01 71.12,14.22 62.23,14.22 63.63,12.83 65.53,10.92 65.53,2.92 62.61,0 80.01,0
VMOTOR
  Top 0.813: MOTOR_SELECT.OUT 37.72,33.91 39.62,35.81 39.62,44.7 41.91,46.99 41.91,62.87 MOTOR_DRIVER.VM
VREG  (via drill 0.35)
  Top 0.508: v29.21,26.54 v29.21,36.45 29.21,40.89 32.38,44.07 SERVO_SELECT.IN3
  Top 0.813: VREG_REGULATOR.OUT2.+ 14.22,19.43 | 14.22,19.43 10.16,23.5 10.16,26.29 VREG_REGULATOR.OUT+ | 14.22,19.43 4.19,19.43 VREG_CONNECTOR.+
  Bottom 0.508: MOTOR_SELECT.IN3 v29.21,36.45 | MOSFET_SELECT.IN3 33.66,28.83 31.37,26.54 v29.21,26.54 27.43,24.77 25.4,24.77 23.5,22.86 23.5,20.32 24.38,19.43 VREG_REGULATOR.OUT2.+
  pour Top: 5.97,37.97 10.16,37.97 16.51,31.62 16.51,24.13 19.68,20.95 26.04,20.95 26.04,18.8 2.29,18.8 2.29,21.34 5.84,24.89 5.84,27.36 7.62,28.1 7.62,34.29 5.97,35.94
  pour Bottom: 36.7,30.1 32.64,30.1 29.97,27.43 22.99,27.43 22.86,27.3 22.86,18.29 27.3,18.29 27.3,22.23 24.77,22.23 24.77,23.62 25.53,22.86 27.94,22.86 27.94,24.26 29.21,25.53 31.62,25.53 31.75,25.4 34.67,25.4 36.7,27.43
VSERVO  (via drill 0.35)
  Top 0.813: SERVO_SELECT.OUT 37.21,43.31 37.21,44.58 36.07,45.72 36.07,61.85 33.66,64.26 27.81,64.26 26.04,66.04 v26.04,81.92 26.04,87 27.3,88.27 30.48,88.27 | SERVO2.VCC 30.48,88.27 | 30.48,88.27 v37.47,88.27
  Bottom 0.813: v26.04,81.92 26.04,83.44 23.5,85.98 3.43,85.98 SERVO1.VCC | v37.47,88.27 67.31,88.27 | 67.31,88.27 SERVO4.VCC SERVO5.VCC SERVO6.VCC | 67.31,88.27 73.66,88.27 76.83,85.09 SERVO3.VCC

### Text on the board
tPlace: SONAR2 | SERVO2 | ANALOG2 | IR SENSOR BAR | ANALOG1 | ANALOG3 | 10K | 10K | 10K | SERVO1 | SERVO3 | I2C 3V3 | SONAR1 | SONAR3 | UART | IMU / AUX | BLUETOOTH / UART 3V3 | 3V3 | 5V | ENCODER1 | ENCODER1 | 3V3 REG | I2C_2 | I2C_1 | LEVEL SHIFTER | 4K7 | VREG | VBAT | VSERVO | I2C PULLUP | + | 5V | MOSFET OUTPUTS | GND | 5V REG | VREG | 10K | VBAT | VMOTOR | POWER SELECTION | VREG | GND | 100K | Vmos | 5V | + | GND | VREG | 10K | VBAT | VMOSFET | 100K | 5V | 5V | GND | Vmos | + | VREG | GND | 10K | REG | 3V3 | ARD | 100K | 3V3 | GND | ARDUINO NANO | Vmos | REG | 5V | ARD | VBAT | POWER ON/OFF | MOTOR A | MOTOR B | BAT / SENSE | GND | VBAT
bPlace: UART_RX | D0 | UART_TX | D1 | ENCODER1 | D2 | ENCODER2 | D3~ | SONAR1 | SERVO1 | D4 | MOSFET1 | SERVO2 | D5~ | MOSFET2 | IR1 | SERVO3 | D6~ | SONAR2 | SERVO4 | D7 | IR2 | SONAR3 | SERVO5 | D8 | MOTOR PWM1 | D9~ | MOTOR PWM2 | D10~ | MOSFET3 | IR3 | SERVO6 | D11~ | MOTOR1 | D12 | PINOUT | MOTOR2 | D13 | MOTOR3 | A0 | MOTOR4 | A1 | ANALOG1 | IR4 | A2 | ANALOG2 | IR5 | A3 | I2C SDA | A4 | I2C SCL | A5 | ANALOG2 | A6 | SENSE | BATTERY | A7 | POWERING | www.luisllamas.es | OPEN ROBOT V1.0 | DO NOT BYPASS ARDUINO 3V3 OR 5V / WITH DC CONVERTERS INSTALLED !!! | POWER SELECTION | ! | USE POWER SELECTOR TO / SELECT 3V3 AND 5V FROM / DC CONVERTERS OR FROM ARDUINO | USE POWER SELECTOR TO / SELECT VMOTOR, VSERVO, VMOSFET | INSTALL REQUIRED DC CONVERTERS / 3V3 -> ESP8266 / 5V -> LOGIC / Vreg -> MOTOR, SERVO, MOSFET